# EasyEDA Pro project STEP Controller.eprj, schematic Schematic1, sheets 2 to 3 of 3

## Sheets
2 MCU: Page Name: MCU; Update Date: 2026-08-10
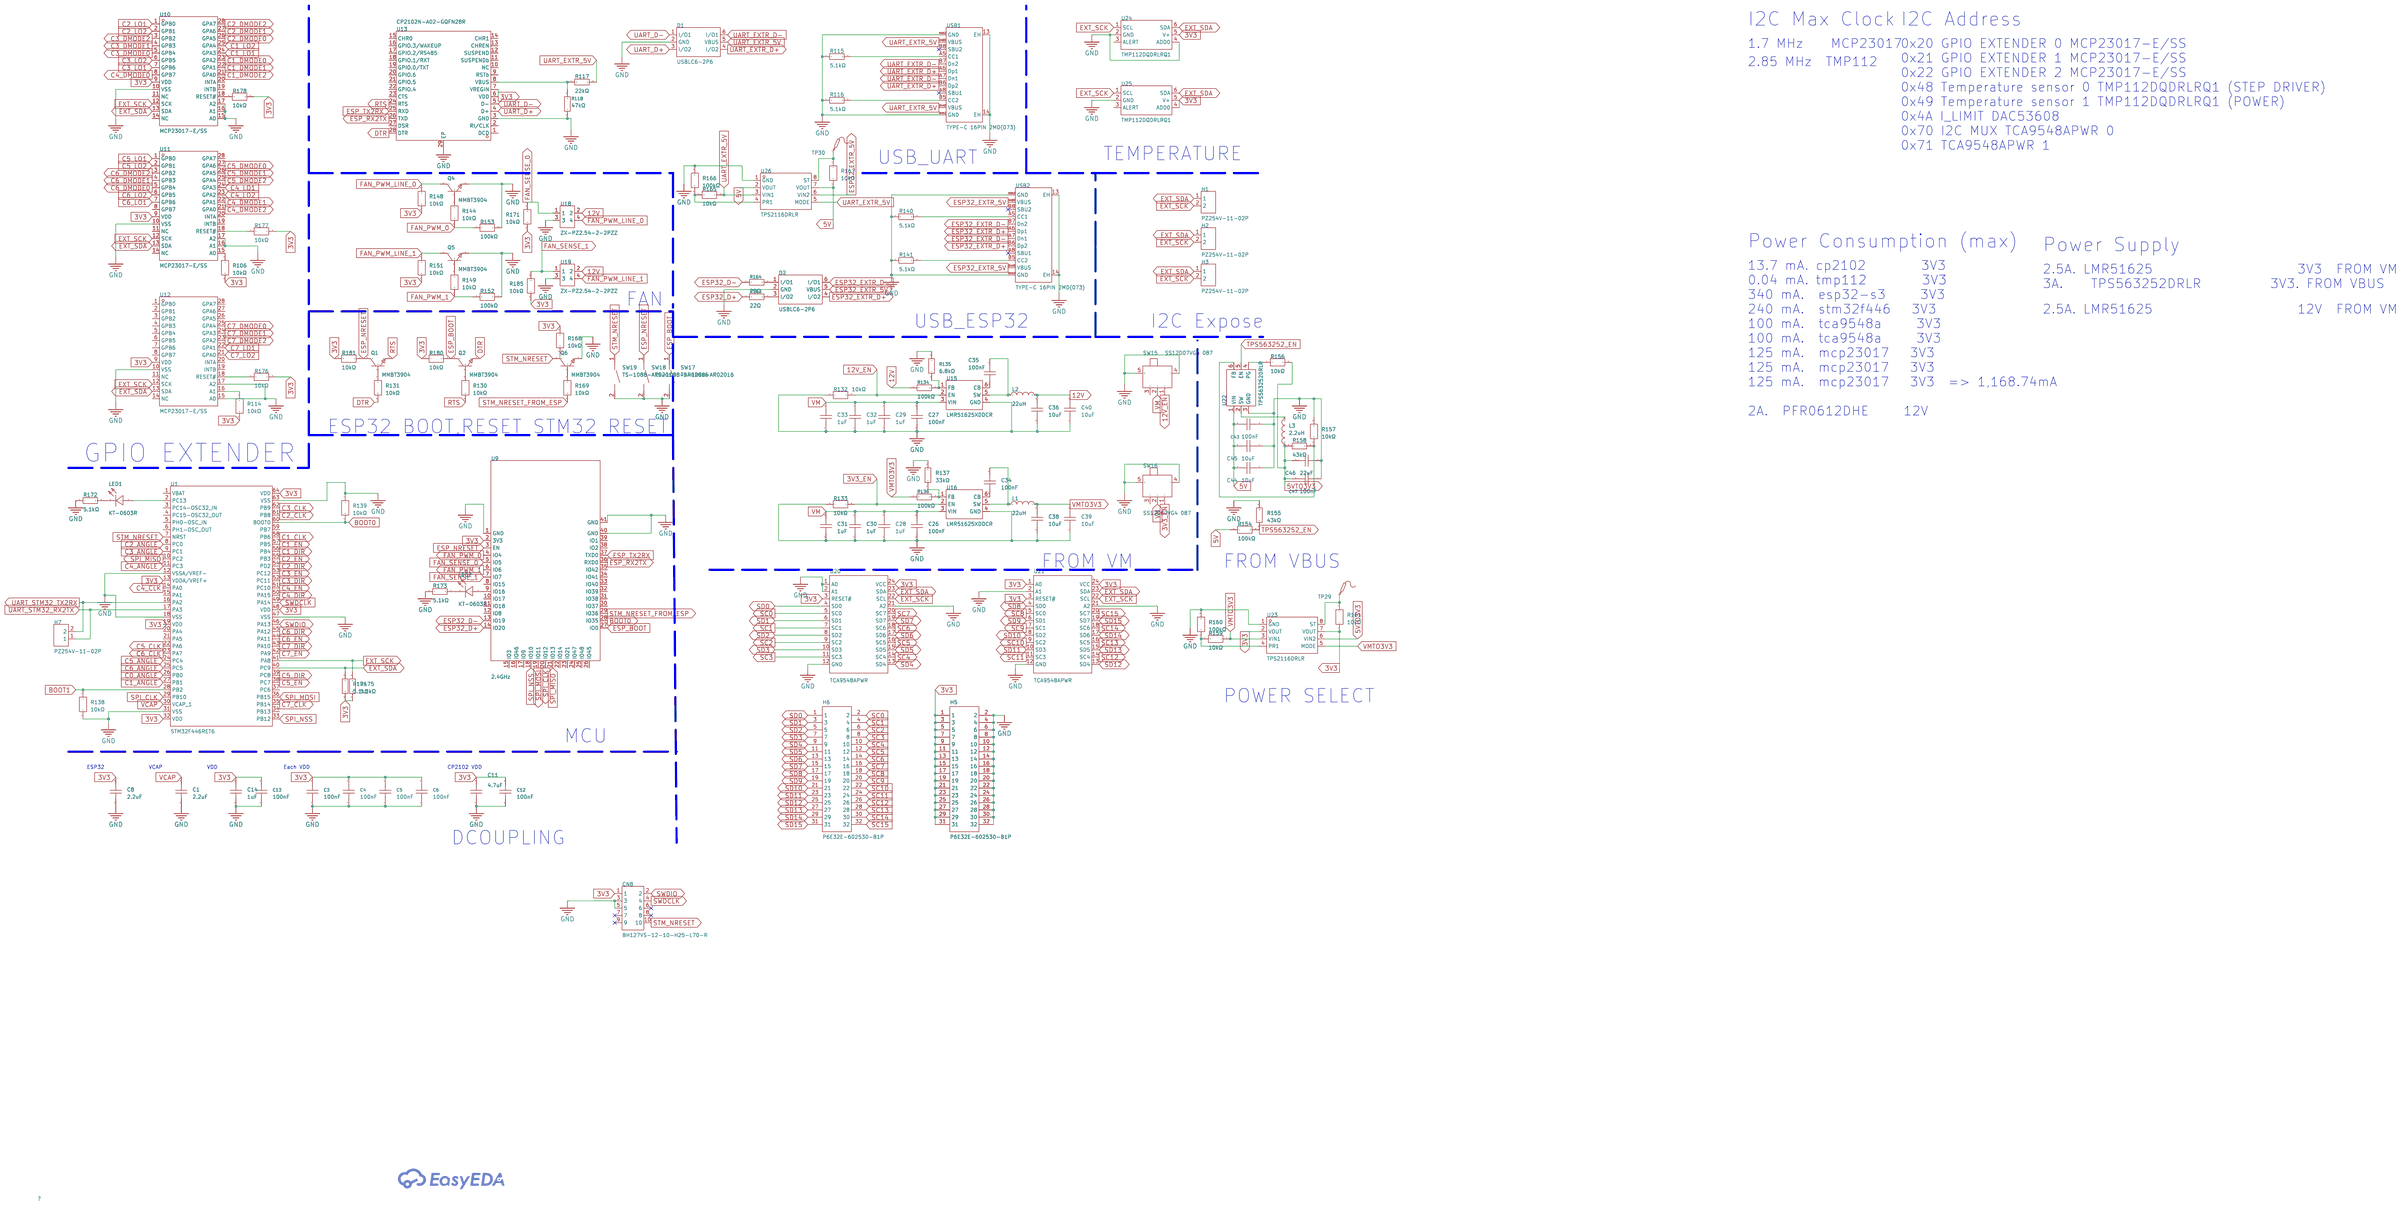
[diagram p1: MCU]
3 UserSelector: Create Date: 2026-05-20; Page Name: UserSelector; Update Date: 2026-06-08
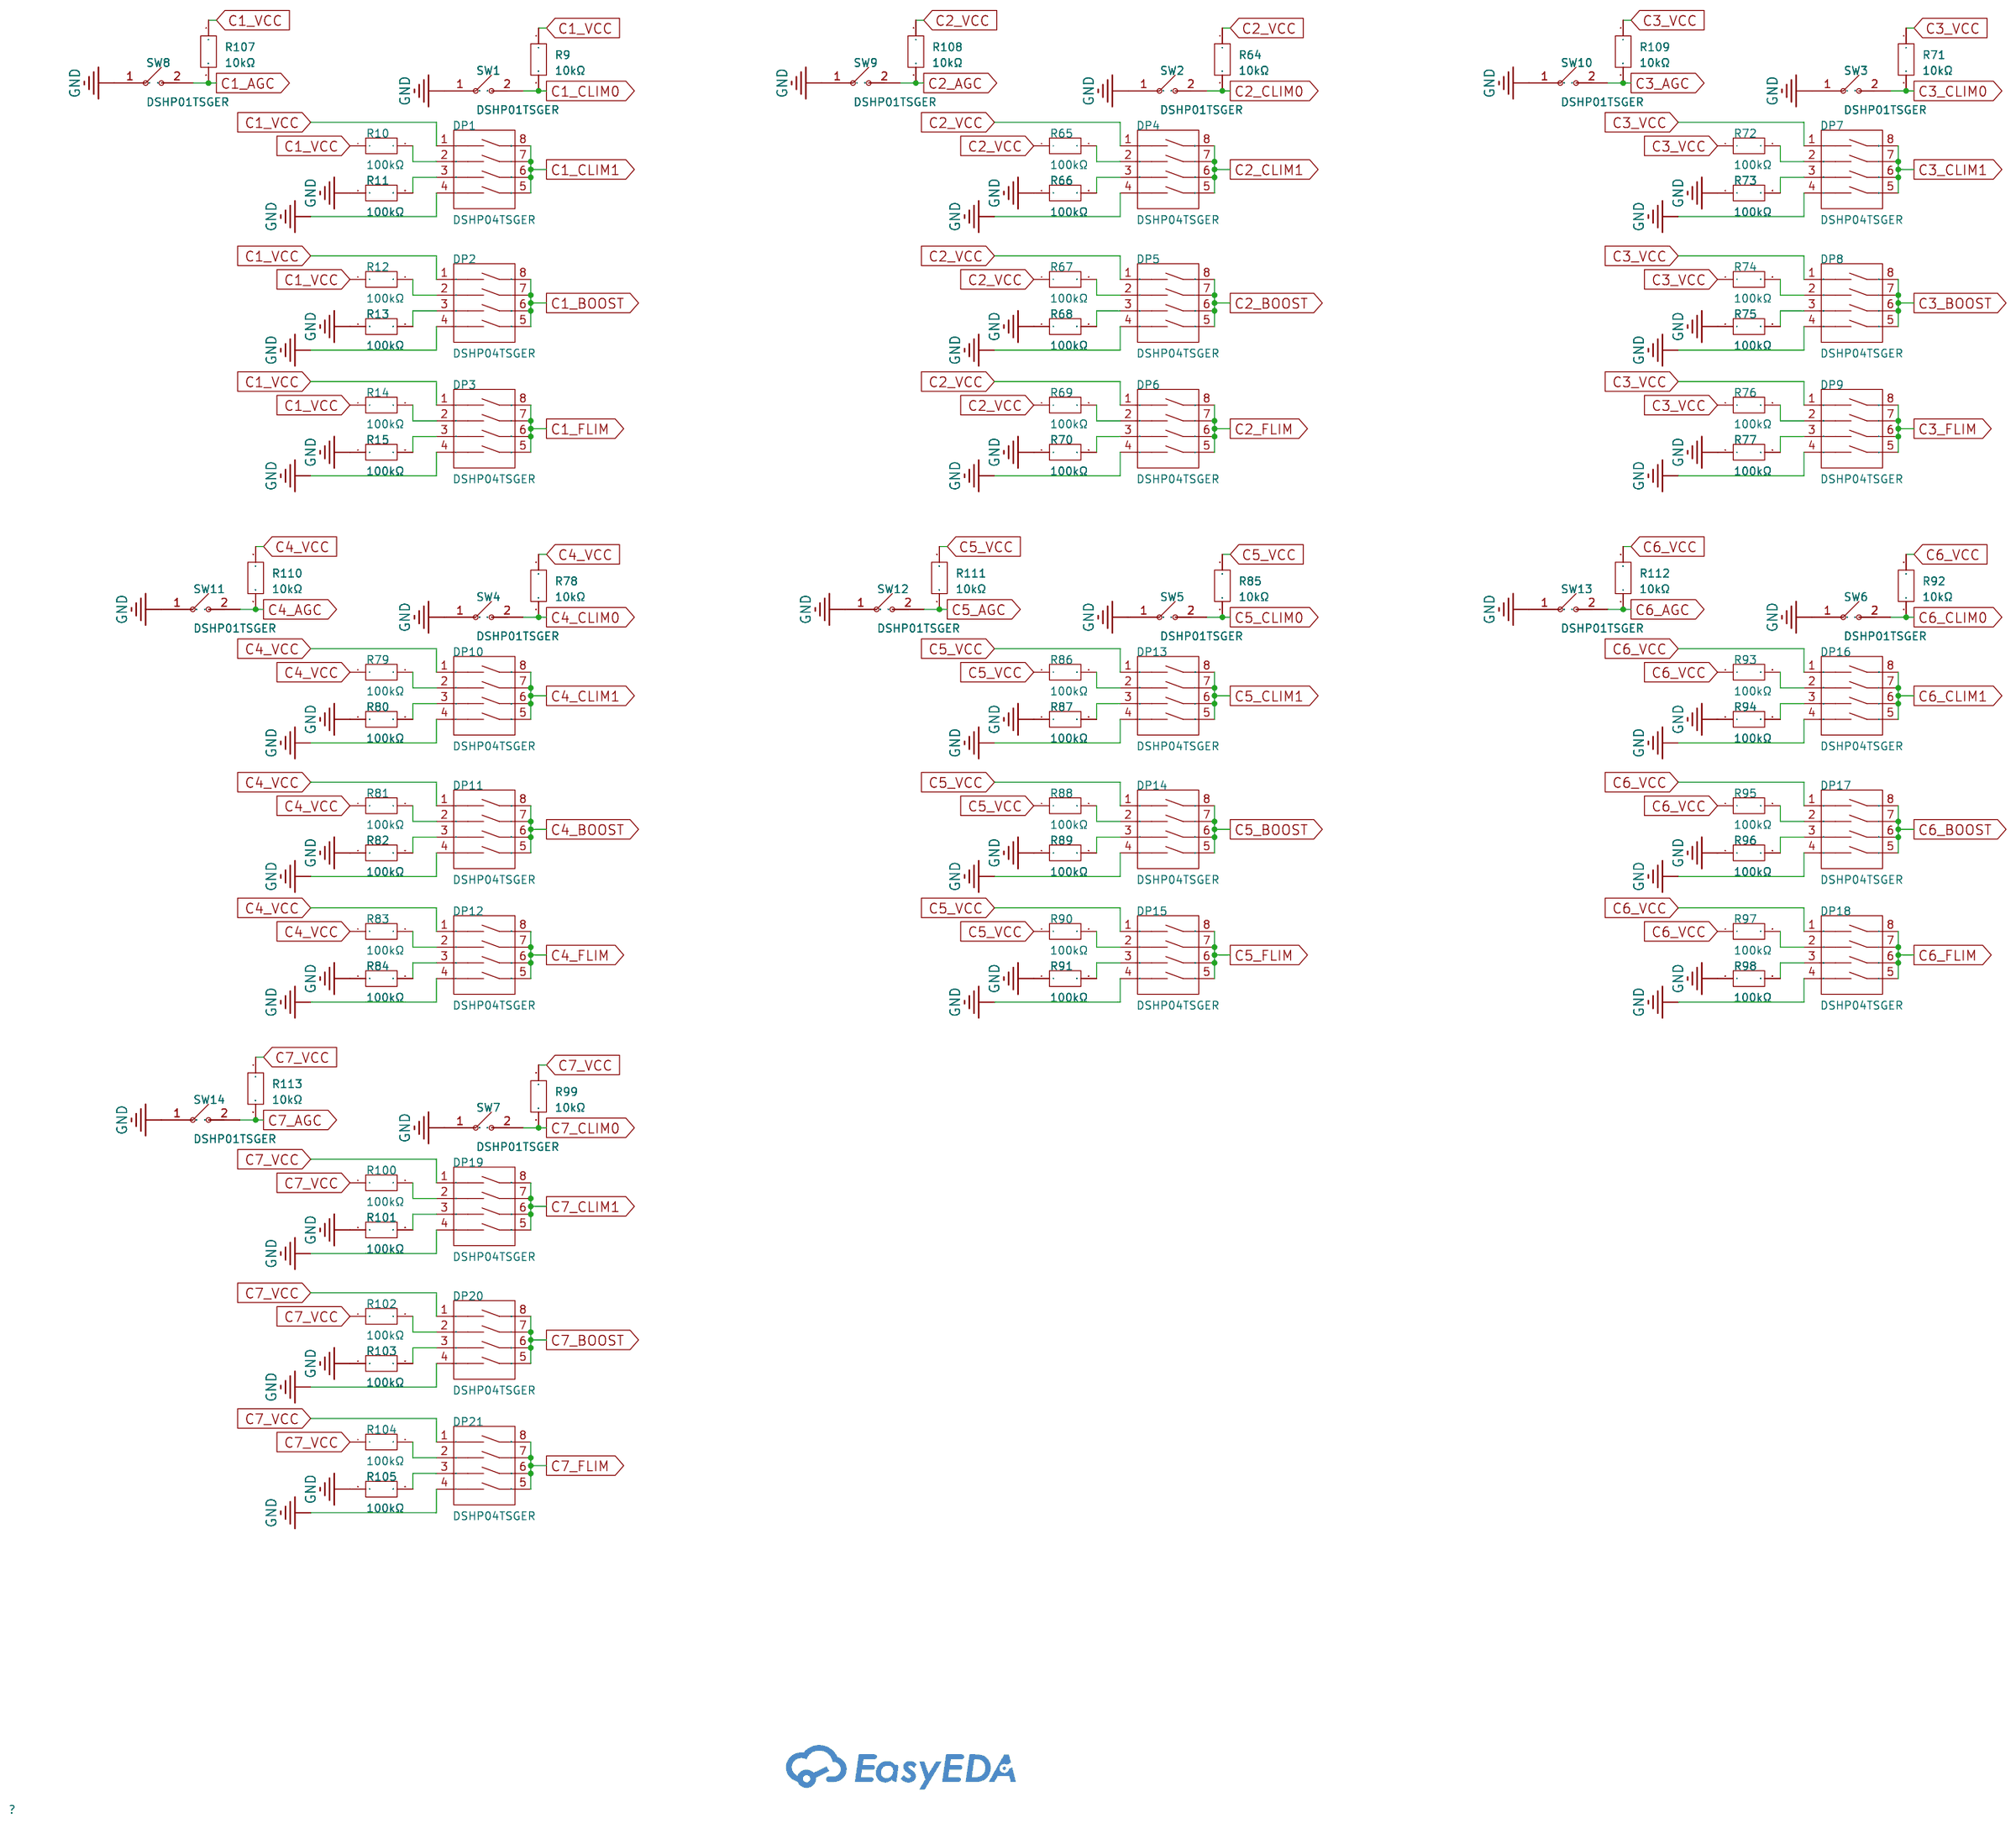
[diagram p2: UserSelector]

## Parts
sheet MCU
C1  2.2uF  [C0603]
C3  100nF  [C0603]
C4  100nF  [C0603]
C5  100nF  [C0603]
C6  100nF  [C0603]
C8  2.2uF  [C0603]
C11  4.7uF  [C0603]
C12  100nF  [C0603]
C13  100nF  [C0603]
C14  1uF  [C0603]
C26  100nF  [C0805]
C27  100nF  [C0805]
C28  1uF  [C0805]
C29  1uF  [C0805]
C30  1uF  [C0805]
C31  1uF  [C0805]
C32  1uF  [C0805]
C33  1uF  [C0805]
C34  100nF  [C0805]
C35  100nF  [C0805]
C36  10uF  [C0805]
C38  10uF  [C0805]
C39  10uF  [C0805]
C40  10uF  [C0805]
C43  100nF  [C0603]
C44  10uF  [C0805]
C45  10uF  [C0805]
C46  22uF  [C0603]
C47  100nF  [C0603]
CN8  BH127VS-12-10-H25-L70-R  [CONN-SMD_10P-P1.27-V-M-R2-C5-LS5.8_BH127VS-12-10-H25-L70-R]
D1  USBLC6-2P6  [SOT-563_L1.6-W1.2-P0.50-LS1.6-BL]
D2  USBLC6-2P6  [SOT-563_L1.6-W1.2-P0.50-LS1.6-BL]
H1  PZ254V-11-02P  [HDR-TH_2P-P2.54-V-M]
H2  PZ254V-11-02P  [HDR-TH_2P-P2.54-V-M]
H3  PZ254V-11-02P  [HDR-TH_2P-P2.54-V-M]
H5  P6E32E-602530-B1P  [HDR-TH_32P-P2.54_P6E32E-602530-B1P]
H6  P6E32E-602530-B1P  [HDR-TH_32P-P2.54_P6E32E-602530-B1P]
H7  PZ254V-11-02P  [HDR-TH_2P-P2.54-V-M]
L1  22uH  [IND-SMD_L10.0-W10.0-LS11.0]
L2  22uH  [IND-SMD_L10.0-W10.0-LS11.0]
L3  2.2uH  [L0805]
LED1  KT-0603R  [LED-SMD_L1.6-W0.8-R-RD]
LED2  KT-0603R  [LED-SMD_L1.6-W0.8-R-RD]
Q1  MMBT3904  [SOT-23-3_L2.9-W1.3-P1.90-LS2.4-BR]
Q2  MMBT3904  [SOT-23-3_L2.9-W1.3-P1.90-LS2.4-BR]
Q4  MMBT3904  [SOT-23-3_L2.9-W1.3-P1.90-LS2.4-BR]
Q5  MMBT3904  [SOT-23-3_L2.9-W1.3-P1.90-LS2.4-BR]
Q6  MMBT3904  [SOT-23-3_L2.9-W1.3-P1.90-LS2.4-BR]
R106  10kΩ  [R0603]
R114  10kΩ  [R0603]
R115  5.1kΩ  [R0603]
R116  5.1kΩ  [R0603]
R117  22kΩ  [R0603]
R118  47kΩ  [R0603]
R130  10kΩ  [R0603]
R131  10kΩ  [R0603]
R132  10kΩ  [R0603]
R133  10kΩ  [R0603]
R134  100kΩ  [R0402]
R135  6.8kΩ  [R0603]
R136  100kΩ  [R0402]
R137  33kΩ  [R0402]
R138  10kΩ  [R0603]
R139  10kΩ  [R0603]
R140  5.1kΩ  [R0603]
R141  5.1kΩ  [R0603]
R144  10kΩ  [R0603]
R148  10kΩ  [R0603]
R149  10kΩ  [R0603]
R151  10kΩ  [R0603]
R152  100kΩ  [R0603]
R153  100kΩ  [R0603]
R154  100kΩ  [R0603]
R155  43kΩ  [R0603]
R156  10kΩ  [R0603]
R157  10kΩ  [R0603]
R158  43kΩ  [R0603]
R159  10kΩ  [R0603]
R160  100kΩ  [R0603]
R161  10kΩ  [R0603]
R163  22Ω  [R0402]
R164  22Ω  [R0402]
R165  10kΩ  [R0603]
R166  100kΩ  [R0603]
R167  10kΩ  [R0603]
R168  10kΩ  [R0603]
R169  10kΩ  [R0603]
R171  10kΩ  [R0603]
R172  5.1kΩ  [R0603]
R173  5.1kΩ  [R0603]
R174  5.1kΩ  [R0603]
R175  5.1kΩ  [R0603]
R176  10kΩ  [R0603]
R177  10kΩ  [R0603]
R178  10kΩ  [R0603]
R180  10kΩ  [R0603]
R181  10kΩ  [R0603]
R185  10kΩ  [R0603]
SW15  SS12D07VG4 087  [SW-TH_SS12D07VG4]
SW16  SS12D07VG4 087  [SW-TH_SS12D07VG4]
SW17  TS-1088-AR02016  [SW-SMD_L3.9-W3.0-P4.45]
SW18  TS-1088-AR02016  [SW-SMD_L3.9-W3.0-P4.45]
SW19  TS-1088-AR02016  [SW-SMD_L3.9-W3.0-P4.45]
TP29  -  [Test-Point-0.5mm]
TP30  -  [Test-Point-0.5mm]
U1  STM32F446RET6  [LQFP-64_L10.0-W10.0-P0.50-LS12.0-BL]
U9  2.4GHz  [WIRELM-SMD_ESP32-S3-WROOM-1]
U10  MCP23017-E/SS  [SSOP-28_L10.2-W5.3-P0.65-LS7.8-BL]
U11  MCP23017-E/SS  [SSOP-28_L10.2-W5.3-P0.65-LS7.8-BL]
U12  MCP23017-E/SS  [SSOP-28_L10.2-W5.3-P0.65-LS7.8-BL]
U13  CP2102N-A02-GQFN28R  [QFN-28_L5.0-W5.0-P0.50-TL-EP3.3]
U15  LMR51625XDDCR  [SOT-23-6_L2.9-W1.6-P0.95-LS2.9-BL]
U16  LMR51625XDDCR  [SOT-23-6_L2.9-W1.6-P0.95-LS2.9-BL]
U18  ZX-PZ2.54-2-2PZZ  [HDR-TH_4P-P2.54-V-M-R2-C2-S2.54]
U19  ZX-PZ2.54-2-2PZZ  [HDR-TH_4P-P2.54-V-M-R2-C2-S2.54]
U20  TCA9548APWR  [TSSOP-24_L7.8-W4.4-P0.65-LS6.4-BL]
U21  TCA9548APWR  [TSSOP-24_L7.8-W4.4-P0.65-LS6.4-BL]
U22  TPS563252DRLR  [SOT-563-6_L1.6-W1.2-P0.50-LS1.6-BL]
U23  TPS2116DRLR  [SOT-583-8_L2.1-W1.6-P0.50-LS1.6-BL]
U24  TMP112DQDRLRQ1  [SOT-563-6_L1.6-W1.2-P0.50-LS1.6-BL]
U25  TMP112DQDRLRQ1  [SOT-563-6_L1.6-W1.2-P0.50-LS1.6-BL]
U26  TPS2116DRLR  [SOT-583-8_L2.1-W1.6-P0.50-LS1.6-BL]
USB1  TYPE-C 16PIN 2MD(073)  [USB-C-SMD_TYPE-C-16PIN-2MD-073]
USB2  TYPE-C 16PIN 2MD(073)  [USB-C-SMD_TYPE-C-16PIN-2MD-073]
sheet UserSelector
DP1  DSHP04TSGER  [SW-SMD_8P-L6.7-W5.4-P1.27-LS8.4]
DP2  DSHP04TSGER  [SW-SMD_8P-L6.7-W5.4-P1.27-LS8.4]
DP3  DSHP04TSGER  [SW-SMD_8P-L6.7-W5.4-P1.27-LS8.4]
DP4  DSHP04TSGER  [SW-SMD_8P-L6.7-W5.4-P1.27-LS8.4]
DP5  DSHP04TSGER  [SW-SMD_8P-L6.7-W5.4-P1.27-LS8.4]
DP6  DSHP04TSGER  [SW-SMD_8P-L6.7-W5.4-P1.27-LS8.4]
DP7  DSHP04TSGER  [SW-SMD_8P-L6.7-W5.4-P1.27-LS8.4]
DP8  DSHP04TSGER  [SW-SMD_8P-L6.7-W5.4-P1.27-LS8.4]
DP9  DSHP04TSGER  [SW-SMD_8P-L6.7-W5.4-P1.27-LS8.4]
DP10  DSHP04TSGER  [SW-SMD_8P-L6.7-W5.4-P1.27-LS8.4]
DP11  DSHP04TSGER  [SW-SMD_8P-L6.7-W5.4-P1.27-LS8.4]
DP12  DSHP04TSGER  [SW-SMD_8P-L6.7-W5.4-P1.27-LS8.4]
DP13  DSHP04TSGER  [SW-SMD_8P-L6.7-W5.4-P1.27-LS8.4]
DP14  DSHP04TSGER  [SW-SMD_8P-L6.7-W5.4-P1.27-LS8.4]
DP15  DSHP04TSGER  [SW-SMD_8P-L6.7-W5.4-P1.27-LS8.4]
DP16  DSHP04TSGER  [SW-SMD_8P-L6.7-W5.4-P1.27-LS8.4]
DP17  DSHP04TSGER  [SW-SMD_8P-L6.7-W5.4-P1.27-LS8.4]
DP18  DSHP04TSGER  [SW-SMD_8P-L6.7-W5.4-P1.27-LS8.4]
DP19  DSHP04TSGER  [SW-SMD_8P-L6.7-W5.4-P1.27-LS8.4]
DP20  DSHP04TSGER  [SW-SMD_8P-L6.7-W5.4-P1.27-LS8.4]
DP21  DSHP04TSGER  [SW-SMD_8P-L6.7-W5.4-P1.27-LS8.4]
R9  10kΩ  [R0603]
R10  100kΩ  [R0603]
R11  100kΩ  [R0603]
R12  100kΩ  [R0603]
R13  100kΩ  [R0603]
R14  100kΩ  [R0603]
R15  100kΩ  [R0603]
R64  10kΩ  [R0603]
R65  100kΩ  [R0603]
R66  100kΩ  [R0603]
R67  100kΩ  [R0603]
R68  100kΩ  [R0603]
R69  100kΩ  [R0603]
R70  100kΩ  [R0603]
R71  10kΩ  [R0603]
R72  100kΩ  [R0603]
R73  100kΩ  [R0603]
R74  100kΩ  [R0603]
R75  100kΩ  [R0603]
R76  100kΩ  [R0603]
R77  100kΩ  [R0603]
R78  10kΩ  [R0603]
R79  100kΩ  [R0603]
R80  100kΩ  [R0603]
R81  100kΩ  [R0603]
R82  100kΩ  [R0603]
R83  100kΩ  [R0603]
R84  100kΩ  [R0603]
R85  10kΩ  [R0603]
R86  100kΩ  [R0603]
R87  100kΩ  [R0603]
R88  100kΩ  [R0603]
R89  100kΩ  [R0603]
R90  100kΩ  [R0603]
R91  100kΩ  [R0603]
R92  10kΩ  [R0603]
R93  100kΩ  [R0603]
R94  100kΩ  [R0603]
R95  100kΩ  [R0603]
R96  100kΩ  [R0603]
R97  100kΩ  [R0603]
R98  100kΩ  [R0603]
R99  10kΩ  [R0603]
R100  100kΩ  [R0603]
R101  100kΩ  [R0603]
R102  100kΩ  [R0603]
R103  100kΩ  [R0603]
R104  100kΩ  [R0603]
R105  100kΩ  [R0603]
R107  10kΩ  [R0603]
R108  10kΩ  [R0603]
R109  10kΩ  [R0603]
R110  10kΩ  [R0603]
R111  10kΩ  [R0603]
R112  10kΩ  [R0603]
R113  10kΩ  [R0603]
SW1  DSHP01TSGER  [SW-SMD_DSHP01TSGER]
SW2  DSHP01TSGER  [SW-SMD_DSHP01TSGER]
SW3  DSHP01TSGER  [SW-SMD_DSHP01TSGER]
SW4  DSHP01TSGER  [SW-SMD_DSHP01TSGER]
SW5  DSHP01TSGER  [SW-SMD_DSHP01TSGER]
SW6  DSHP01TSGER  [SW-SMD_DSHP01TSGER]
SW7  DSHP01TSGER  [SW-SMD_DSHP01TSGER]
SW8  DSHP01TSGER  [SW-SMD_DSHP01TSGER]
SW9  DSHP01TSGER  [SW-SMD_DSHP01TSGER]
SW10  DSHP01TSGER  [SW-SMD_DSHP01TSGER]
SW11  DSHP01TSGER  [SW-SMD_DSHP01TSGER]
SW12  DSHP01TSGER  [SW-SMD_DSHP01TSGER]
SW13  DSHP01TSGER  [SW-SMD_DSHP01TSGER]
SW14  DSHP01TSGER  [SW-SMD_DSHP01TSGER]

## Library data of the parts
C1 C8 = CL10A225KO8NNNC: Capacitance:2.2uF Tolerance:±10% Tolerance:±10% Voltage Rating:16V Temperature Coefficient:X5R; LCSC Part Name: 2.2uF ±10% 16V; Supplier Part: C23630; Manufacturer: SAMSUNG(三星); Supplier Footprint: 0603; JLCPCB Part Class: Basic Part; Datasheet: https://item.szlcsc.com/datasheet/CL10A225KO8NNNC/24366.html; Supplier: LCSC; Tolerance: ±10%; Voltage Rating: 16V; Temperature Coefficient: X5R
C3-C6 C12 C13 C43 C47 = CC0603KRX7R9BB104: Capacitance:100nF Tolerance:±10% Tolerance:±10% Voltage Rating:50V Temperature Coefficient:X7R; LCSC Part Name: 100nF ±10% 50V; Supplier Part: C14663; Manufacturer: YAGEO(国巨); Supplier Footprint: 0603; JLCPCB Part Class: Basic Part; Datasheet: https://item.szlcsc.com/datasheet/CC0603KRX7R9BB104/15331.html; Supplier: LCSC; Tolerance: ±10%; Voltage Rating: 50V; Temperature Coefficient: X7R
C11 = CL10A475KO8NNNC: Capacitance:4.7uF Tolerance:±10% Tolerance:±10% Voltage Rating:16V Temperature Coefficient:X5R; LCSC Part Name: 4.7uF ±10% 16V; Supplier Part: C19666; Manufacturer: SAMSUNG(三星); Supplier Footprint: 0603; JLCPCB Part Class: Basic Part; Datasheet: https://item.szlcsc.com/datasheet/CL10A475KO8NNNC/20375.html; Supplier: LCSC; Tolerance: ±10%; Voltage Rating: 16V; Temperature Coefficient: X5R
C14 = CL10A105KB8NNNC: LCSC Part Name: 1uF ±10% 50V; Supplier Part: C15849; Manufacturer: SAMSUNG(三星); Supplier Footprint: 0603; JLCPCB Part Class: Basic Part; Datasheet: https://item.szlcsc.com/datasheet/CL10A105KB8NNNC/16531.html; Supplier: LCSC; Tolerance: ±10%; Voltage Rating: 50V; Temperature Coefficient: X5R
C26 C27 C34 C35 = CL21B104KCFNNNE: Capacitance:100nF Tolerance:±10% Tolerance:±10% Voltage Rating:100V Temperature Coefficient:X7R; LCSC Part Name: 100nF ±10% 100V; Supplier Part: C28233; Manufacturer: SAMSUNG(三星); Supplier Footprint: 0805; JLCPCB Part Class: Basic Part; Datasheet: https://item.szlcsc.com/datasheet/CL21B104KCFNNNE/28983.html; Supplier: LCSC; Tolerance: ±10%; Voltage Rating: 100V; Temperature Coefficient: X7R
C28-C33 = HHV0805R7105K101NSLJ: Capacitance:1uF Tolerance:±10% Tolerance:±10% Voltage Rating:100V Temperature Coefficient:X7R; LCSC Part Name: 1uF ±10% 100V; Supplier Part: C22367837; Manufacturer: Chinocera(华瓷); Supplier Footprint: 0805; JLCPCB Part Class: Extended Part; Datasheet: https://item.szlcsc.com/datasheet/HHV0805R7105K101NSLJ/23841142.html; Supplier: LCSC; Tolerance: ±10%; Voltage Rating: 100V; Temperature Coefficient: X7R
C36 C38-C40 C44 C45 = CL21A106KAYNNNE_C15850: LCSC Part Name: 10uF ±10% 25V; Supplier Part: C15850; Manufacturer: SAMSUNG(三星); Manufacturer Part: CL21A106KAYNNNE; Supplier Footprint: 0805; JLCPCB Part Class: Basic Part; Datasheet: https://item.szlcsc.com/datasheet/CL21A106KAYNNNE/16532.html; Supplier: LCSC; Tolerance: ±10%; Voltage Rating: 25V; Temperature Coefficient: X5R
C46 = CL10A226MQ8NRNC: LCSC Part Name: 22uF ±20% 6.3V; Supplier Part: C59461; Manufacturer: SAMSUNG(三星); Supplier Footprint: 0603; JLCPCB Part Class: Basic Part; Datasheet: https://item.szlcsc.com/datasheet/CL10A226MQ8NRNC/60514.html; Supplier: LCSC; Tolerance: ±20%; Voltage Rating: 6.3V; Temperature Coefficient: X5R
CN8 = BH127VS-12-10-H25-L70-R: LCSC Part Name: 1.27mm 2x5P 排数:2 每排P数:5; Supplier Part: C46971078; Manufacturer: XFCN(兴飞); Supplier Footprint: SMD,P=1.27mm; JLCPCB Part Class: Extended Part; Datasheet: https://item.szlcsc.com/datasheet/BH127VS-12-10-H25-L70-R/49149235.html; Supplier: LCSC; Pitch: 1.27mm; Number of Positions or Pins: 2x5P; Current Rating: 1A; Holder Type: Surface Mount,Vertical; Number of Rows: 2; Number of PINs Per Row: 5; Contact Material: Brass; Contact Plating: Gold; Operating Temperature: -40℃~+105℃; Color: Black
D1 D2 = USBLC6-2P6_C49451919: LCSC Part Name: 单向 5V 5.5A; Supplier Part: C49451919; Manufacturer: R+O(宏嘉诚); Supplier Footprint: SOT-563; JLCPCB Part Class: Extended Part; Datasheet: https://item.szlcsc.com/datasheet/USBLC6-2P6/51998875.html; Supplier: LCSC; Polarity: Unidirectional; Reverse Stand-Off Voltage (Vrwm): 5V; Clamping Voltage: 14V; Peak Pulse Current (Ipp): 5.5A; Peak Pulse Power Dissipation (Ppp): 80W; Voltage - Breakdown: 6V; Reverse Leakage Current (Ir): 80nA; Number of Channels: 2; Operating Temperature: -55℃~+150℃; Type: ESD; Junction Capacitance: 0.5pF
H1-H3 H7 = PZ254V-11-02P: LCSC Part Name: 1x2P 间距:2.54mm 方针 直插; Supplier Part: C492401; Manufacturer: XFCN(兴飞); Supplier Footprint: 插件,P=2.54mm; JLCPCB Part Class: Extended Part; Datasheet: https://item.szlcsc.com/datasheet/PZ254V-11-02P/502957.html; Supplier: LCSC; Pin Structure: 1x2P; Pitch: 2.54mm; Circluar Pins/Square Pins: Pin Header; Mounting Type: Through Hole; Number of Rows: 1; Number of Pins: 2P; Current Rating: 3A; Voltage Rating (Max): 250V; Length of Mating Pin: 6mm; Insulation Height: 2.5mm; Length of End Connection Pin: 3mm; Contact Material: Brass; Operating Temperature: -40℃~+105℃; Color: Black
H5 H6 = P6E32E-602530-B1P: Pin Structure:2x16P Pitch:2.54mm Row Spacing:2.54mm Circluar Pins/Square Pins:Pin Header Mounting Type:Through Hole Number of Rows:2 Number of Pins:32P Current Rating:3A Voltage Rating (Max):250V Length of Mating Pin:6mm Insulation Height:2.5mm Length of; LCSC Part Name: 2x16P 间距:2.54mm 方针 直插; Supplier Part: C49451395; Manufacturer: CHIN-BAN(勤本); Supplier Footprint: 插件,P=2.54mm; JLCPCB Part Class: Extended Part; Datasheet: https://item.szlcsc.com/datasheet/P6E32E-602530-B1P/51996702.html; Supplier: LCSC; Pin Structure: 2x16P; Pitch: 2.54mm; Row Spacing: 2.54mm; Circluar Pins/Square Pins: Pin Header; Mounting Type: Through Hole; Number of Rows: 2; Number of Pins: 32P; Current Rating: 3A; Voltage Rating (Max): 250V; Length of Mating Pin: 6mm; Insulation Height: 2.5mm; Length of End Connection Pin: 3mm; Contact Material: Brass; Contact Plating: Gold; Operating Temperature: -40℃~+105℃; Color: Black
L1 L2 = FXL1040-220-M: LCSC Part Name: 22uH ±20% 5.5A; Supplier Part: C475917; Manufacturer: cjiang(长江微电); Supplier Footprint: SMD,11.5x10mm; JLCPCB Part Class: Extended Part; Datasheet: https://item.szlcsc.com/datasheet/FXL1040-220-M/482450.html; Supplier: LCSC; Tolerance: ±20%; Current Rating: 5A; Current - Saturation(Isat): 5.5A; DC Resistance(DCR): 66mΩ; Type: Molded Inductor
L3 = CMI201209U2R2KT: LCSC Part Name: 2.2uH ±10%; Supplier Part: C1043; Manufacturer: FH(风华); Supplier Footprint: 0805; JLCPCB Part Class: Extended Part; Datasheet: https://item.szlcsc.com/datasheet/CMI201209U2R2KT/1395.html; Supplier: LCSC; Tolerance: ±10%; Current Rating: 50mA; DC Resistance(DCR): 600mΩ; Q @ Frequency: 35@10MHz; Frequency - Self Resonant: 50MHz
LED1 LED2 = KT-0603R: LCSC Part Name: 0603 红灯 高亮; Supplier Part: C2286; Manufacturer: KENTO; Supplier Footprint: 0603; JLCPCB Part Class: Basic Part; Datasheet: https://item.szlcsc.com/datasheet/KT-0603R/2659.html; Supplier: LCSC; Lamp Holder Type: 1.6mm x 0.8mm square LED; Illumination Color: Red; Voltage - Forward(Vf): 1.8V~2.4V; Power(Watts): 40mW; Forward Current: 20mA; Wavelength - Dominant: 615nm~630nm; Peak Wavelength: 645nm; Diode Configuration: Discrete Diode; Lens Color: Water Clear; Luminous Intensity: 300mcd; Viewing Angle: 120°; Operating Temperature: -40℃~+85℃
Q1 Q2 Q4-Q6 = MMBT3904_C51953474: LCSC Part Name: MMBT3904 hFE:100-300 NPN 晶体管 电流：200mA 电压：40V; Supplier Part: C51953474; Manufacturer: CCX(晁禾); Supplier Footprint: SOT-23; JLCPCB Part Class: Extended Part; Datasheet: https://item.szlcsc.com/datasheet/MMBT3904/54682184.html; Supplier: LCSC; type: NPN; Current - Collector(Ic): 200mA; Collector - Emitter Voltage VCEO: 40V; Pd - Power Dissipation: 200mW; DC Current Gain: 300@10mA,1V; Transition frequency(fT): 300MHz; Current - Collector Cutoff: 100nA; Vce Saturation(VCE(sat)): 300mV@50mA,5mA; Operating Temperature: -55℃~+150℃; Emitter-Base Voltage(Vebo): 6V; Number: 1 NPN Transistor
R9 R64 R71 R78 R85 R92 R99 R106-R114 R130-R133 R138 R139 R144 R148 R149 R151 R156 R157 R159 R161 R165 R167-R169 R171 R176-R178 R180 R181 R185 = 0603WAF1002T5E: Type:Thick Film Resistor Resistance:10kΩ Tolerance:±1% Tolerance:±1% Power(Watts):100mW Voltage-Supply(Max):75V Temperature Coefficient:±100ppm/℃ Temperature Coefficient:±100ppm/℃ Operating Temperature:-55℃~+155℃ Operating Temperature:-55℃~+155℃; LCSC Part Name: 厚膜电阻 10kΩ ±1% 100mW; Supplier Part: C25804; Manufacturer: UNI-ROYAL(厚声); Supplier Footprint: 0603; JLCPCB Part Class: Basic Part; Datasheet: https://item.szlcsc.com/datasheet/0603WAF1002T5E/26547.html; Supplier: LCSC; Type: Thick Film Resistor; Tolerance: ±1%; Power(Watts): 100mW; Voltage-Supply(Max): 75V; Temperature Coefficient: ±100ppm/℃; Operating Temperature: -55℃~+155℃
R115 R116 R140 R141 R172-R175 = 0603WAF5101T5E: Type:Thick Film Resistor Resistance:5.1kΩ Tolerance:±1% Tolerance:±1% Power(Watts):100mW Voltage-Supply(Max):75V Temperature Coefficient:±100ppm/℃ Temperature Coefficient:±100ppm/℃ Operating Temperature:-55℃~+155℃ Operating Temperature:-55℃~+155℃; LCSC Part Name: 5.1kΩ ±1% 100mW 厚膜电阻; Supplier Part: C23186; Manufacturer: UNI-ROYAL(厚声); Supplier Footprint: 0603; JLCPCB Part Class: Basic Part; Datasheet: https://item.szlcsc.com/datasheet/0603WAF5101T5E/23913.html; Supplier: LCSC; Type: Thick Film Resistor; Tolerance: ±1%; Power(Watts): 100mW; Voltage-Supply(Max): 75V; Temperature Coefficient: ±100ppm/℃; Operating Temperature: -55℃~+155℃
R117 = 0603WAF2202T5E: Type:Thick Film Resistor Resistance:22kΩ Tolerance:±1% Tolerance:±1% Power(Watts):100mW Voltage-Supply(Max):75V Temperature Coefficient:±100ppm/℃ Temperature Coefficient:±100ppm/℃ Operating Temperature:-55℃~+155℃ Operating Temperature:-55℃~+155℃; LCSC Part Name: 22kΩ ±1% 100mW 厚膜电阻; Supplier Part: C31850; Manufacturer: UNI-ROYAL(厚声); Supplier Footprint: 0603; JLCPCB Part Class: Basic Part; Datasheet: https://item.szlcsc.com/datasheet/0603WAF2202T5E/32812.html; Supplier: LCSC; Type: Thick Film Resistor; Tolerance: ±1%; Power(Watts): 100mW; Voltage-Supply(Max): 75V; Temperature Coefficient: ±100ppm/℃; Operating Temperature: -55℃~+155℃
R118 = 0603WAF4702T5E: Type:Thick Film Resistor Resistance:47kΩ Tolerance:±1% Tolerance:±1% Power(Watts):100mW Voltage-Supply(Max):75V Temperature Coefficient:±100ppm/℃ Temperature Coefficient:±100ppm/℃ Operating Temperature:-55℃~+155℃ Operating Temperature:-55℃~+155℃; LCSC Part Name: 47kΩ ±1% 100mW 厚膜电阻; Supplier Part: C25819; Manufacturer: UNI-ROYAL(厚声); Supplier Footprint: 0603; JLCPCB Part Class: Basic Part; Datasheet: https://item.szlcsc.com/datasheet/0603WAF4702T5E/26562.html; Supplier: LCSC; Type: Thick Film Resistor; Tolerance: ±1%; Power(Watts): 100mW; Voltage-Supply(Max): 75V; Temperature Coefficient: ±100ppm/℃; Operating Temperature: -55℃~+155℃
R134 R136 = 0402WGF1003TCE: LCSC Part Name: 100kΩ ±1% 62.5mW 厚膜电阻; Supplier Part: C25741; Manufacturer: UNI-ROYAL(厚声); Supplier Footprint: 0402; JLCPCB Part Class: Basic Part; Datasheet: https://item.szlcsc.com/datasheet/0402WGF1003TCE/26484.html; Supplier: LCSC; Type: Thick Film Resistor; Tolerance: ±1%; Power(Watts): 62.5mW; Voltage-Supply(Max): 50V; Temperature Coefficient: ±100ppm/℃; Operating Temperature: -55℃~+155℃
R135 = 0603WAF6801T5E: LCSC Part Name: 6.8kΩ ±1% 100mW 厚膜电阻; Supplier Part: C23212; Manufacturer: UNI-ROYAL(厚声); Supplier Footprint: 0603; JLCPCB Part Class: Basic Part; Datasheet: https://item.szlcsc.com/datasheet/0603WAF6801T5E/23939.html; Supplier: LCSC; Type: Thick Film Resistor; Tolerance: ±1%; Power(Watts): 100mW; Voltage-Supply(Max): 75V; Temperature Coefficient: ±100ppm/℃; Operating Temperature: -55℃~+155℃
R137 = 0402WGF3302TCE: LCSC Part Name: 33kΩ ±1% 62.5mW 厚膜电阻; Supplier Part: C25779; Manufacturer: UNI-ROYAL(厚声); Supplier Footprint: 0402; JLCPCB Part Class: Basic Part; Datasheet: https://atta.szlcsc.com/upload/public/pdf/source/20200306/C422600_1E6D84923E4A46A82E41ADD87F860B5C.pdf; Supplier: LCSC; Type: Thick Film Resistors; Tolerance: ±1%; Temperature Coefficient: ±100ppm/℃; Operating Temperature Range: -55℃~+155℃
R10-R15 R65-R70 R72-R77 R79-R84 R86-R91 R93-R98 R100-R105 R152-R154 R160 R166 = 0603WAF1003T5E: Type:Thick Film Resistor Resistance:100kΩ Tolerance:±1% Tolerance:±1% Power(Watts):100mW Voltage-Supply(Max):75V Temperature Coefficient:±100ppm/℃ Temperature Coefficient:±100ppm/℃ Operating Temperature:-55℃~+155℃ Operating Temperature:-55℃~+155℃; LCSC Part Name: 100kΩ ±1% 100mW 厚膜电阻; Supplier Part: C25803; Manufacturer: UNI-ROYAL(厚声); Supplier Footprint: 0603; JLCPCB Part Class: Basic Part; Datasheet: https://item.szlcsc.com/datasheet/0603WAF1003T5E/26546.html; Supplier: LCSC; Type: Thick Film Resistor; Tolerance: ±1%; Power(Watts): 100mW; Voltage-Supply(Max): 75V; Temperature Coefficient: ±100ppm/℃; Operating Temperature: -55℃~+155℃
R155 R158 = 0603WAF4302T5E: LCSC Part Name: 43kΩ ±1% 100mW 厚膜电阻; Supplier Part: C23172; Manufacturer: UNI-ROYAL(厚声); Supplier Footprint: 0603; JLCPCB Part Class: Extended Part; Datasheet: https://item.szlcsc.com/datasheet/0603WAF4302T5E/23899.html; Supplier: LCSC; Type: Thick Film Resistor; Tolerance: ±1%; Power(Watts): 100mW; Voltage-Supply(Max): 75V; Temperature Coefficient: ±100ppm/℃; Operating Temperature: -55℃~+155℃
R163 R164 = 0402WGF220JTCE: LCSC Part Name: 22Ω ±1% 62.5mW 厚膜电阻; Supplier Part: C25092; Manufacturer: UNI-ROYAL(厚声); Supplier Footprint: 0402; JLCPCB Part Class: Basic Part; Datasheet: https://atta.szlcsc.com/upload/public/pdf/source/20200306/C422600_1E6D84923E4A46A82E41ADD87F860B5C.pdf; Supplier: LCSC; Type: Thick Film Resistors; Tolerance: ±1%; Temperature Coefficient: ±100ppm/℃; Operating Temperature Range: -55℃~+155℃
SW15 SW16 = SS12D07VG4 087: LCSC Part Name: SS12D07VG4; Supplier Part: C2939726; Manufacturer: SHOU HAN(首韩); Supplier Footprint: 插件,8.7x4.4mm; JLCPCB Part Class: Extended Part; Datasheet: https://item.szlcsc.com/datasheet/SS12D07VG4%2520087/3301205.html; Supplier: LCSC; Circuit: SPDT; Termination Style: PC Pin; Length: 8.7mm; Width: 4.4mm; Switch Height: 4.7mm; Mounting Type: Through Hole; Current Rating: 500mA; Voltage Rating: 50V; Life: 5,000 cycles; Operating Temperature: -10℃~+50℃
SW17-SW19 = TS-1088-AR02016: LCSC Part Name: 3.9*3*2mm 立贴 轻触开关; Supplier Part: C720477; Manufacturer: XUNPU(讯普); Supplier Footprint: SMD,4x3mm; JLCPCB Part Class: Basic Part; Datasheet: https://item.szlcsc.com/datasheet/TS-1088-AR02016/763484.html; Supplier: LCSC; Circuit: SPST; Actuator Style: Round Button; Operating Force: 1.6N; Mounting Type: Surface Mount,Vertical; Length: 3.9mm; Width: 3mm; Switch Height: 2mm; with Bracket: Without Bracket; Contact Current: 50mA; Voltage Rating: 12V; Actuator/Cap Color: Black; Termination Style: SMD(SMT) Tab; Life: 100,000 cycles; Operating Temperature: -30℃~+80℃
TP29 TP30 = Test-Point
U1 = STM32F446RET6: LCSC Part Name: MSL=3 带DSP和FPU的高性能基础系列ARM Cortex-M4 MCU，具有512 KB Flash、180 MHz CPU、ART加速器和双QSPI; Supplier Part: C69336; Manufacturer: ST(意法半导体); Supplier Footprint: LQFP-64(10x10); JLCPCB Part Class: Extended Part; Datasheet: https://item.szlcsc.com/datasheet/STM32F446RET6/70451.html; Supplier: LCSC; CPU Core: ARM-M4; CPU Maximum Speed: 180MHz; CPU Bit Width: 32bit; Program Storage Size: 512KB; Program Memory Type: FLASH; Number of I/O: 50; ADC (Bit): 12bit; DAC (Bit): 12bit; Voltage - Supply: 1.7V~3.6V
U9 = ESP32-S3-WROOM-1-N16R8: LCSC Part Name: 不带固件 通用型Wi-Fi+低功耗蓝牙MCU模组; Supplier Part: C2913202; Manufacturer: ESPRESSIF(乐鑫); Supplier Footprint: SMD,25.5x18mm; JLCPCB Part Class: Extended Part; Datasheet: https://item.szlcsc.com/datasheet/ESP32-S3-WROOM-1-N16R8/3198300.html; Supplier: LCSC; Utilized IC / Part: ESP32-S3R8; Interface Type: I2C；GPIO；UART；SPI；USB；I2S; Antenna Type: On-board PCB Antenna; Output Power: 20.5dBm; Voltage - Supply: 3V~3.6V; Receive  Current: 95mA; Send  Current: 355mA; Sensitivity: -103.5dBm; Operating Temperature: -40℃~+65℃
U10-U12 = MCP23017-E/SS: LCSC Part Name: 16位带串行接口的I/O扩展器; Supplier Part: C506653; Manufacturer: MICROCHIP(美国微芯); Supplier Footprint: SSOP-28(5.3x10.2x0.65); JLCPCB Part Class: Extended Part; Datasheet: https://item.szlcsc.com/datasheet/MCP23017-E%252FSS/519857.html; Supplier: LCSC; Interface: I2C; Number of I/O: 16; Interrupt Output: Interrupt Output; Voltage - Supply: 1.8V~5.5V; Current - Output Low(IOL): 8mA; Clock Frequency: 1.7MHz; Operating Temperature: -40℃~+125℃; Number of Supporting Devices: 8; Quiescent Current: 1uA; Output Logic Level - Low: 600mV
U13 = CP2102N-A02-GQFN28R: LCSC Part Name: USB转UART桥接器; Supplier Part: C964632; Manufacturer: SKYWORKS/SILICON LABS(芯科); Supplier Footprint: QFN-28-EP(5x5); JLCPCB Part Class: Extended Part; Datasheet: https://item.szlcsc.com/datasheet/CP2102N-A02-GQFN28R/1049893.html; Supplier: LCSC; Applications Function: USB to UART; USB Protocol: USB 2.0; Voltage - Supply: 3V~3.6V; Operating Temperature: -40℃~+85℃@(Ta); Current - Supply: 9.5mA; Quiescent Supply Current: 1.3uA
U15 U16 = LMR51625XDDCR_C44750835: Supplier Part: C44750835; Manufacturer: TI(德州仪器); Supplier Footprint: TSOT-23-6; JLCPCB Part Class: Extended Part; Datasheet: https://www.ti.com/lit/ds/symlink/lmr51625.pdf; Supplier: LCSC
U18 U19 = ZX-PZ2.54-2-2PZZ: LCSC Part Name: 2x2P 间距:2.54mm 方针 直插; Supplier Part: C7501273; Manufacturer: Megastar(兆星); Supplier Footprint: 插件,P=2.54mm; JLCPCB Part Class: Extended Part; Datasheet: https://atta.szlcsc.com/upload/public/pdf/source/20231122/911B69827DB23C9F0677528E625190D5.pdf; Supplier: LCSC; Pin Structure: 2x2P; Pitch: 2.54mm; Row Spacing: 2.54mm; Circluar Pins/Square Pins: Policy; Mounting Type: Straight; Number of Rows: Double Row; Number of Pins: 4P; Current Rating: 3A; Voltage Rating (Max): 1kV; Length of Mating Pin: 6mm; Insulation Height: 2.5mm; Length of End Connection Pin: 3mm; Contact Material: Brass; Contact Plating: Gold; Operating Temperature: -40℃~+105℃; Color: Black
U20 U21 = TCA9548APWR: LCSC Part Name: 支持复位的低压8通道I²C开关; Supplier Part: C130026; Manufacturer: TI(德州仪器); Supplier Footprint: TSSOP-24; JLCPCB Part Class: Extended Part; Datasheet: https://www.ti.com/cn/lit/gpn/tca9548a; Supplier: LCSC
U22 = TPS563252DRLR: LCSC Part Name: 3V至17V输入、3A输出同步降压转换器; Supplier Part: C19188399; Manufacturer: TI(德州仪器); Supplier Footprint: SOT-6(5x3); JLCPCB Part Class: Extended Part; Datasheet: https://item.szlcsc.com/datasheet/TPS563252DRLR/20409048.html; Supplier: LCSC; Voltage - Supply: 3V~17V; Output Current: 3A; Frequency - Switching: 1.2MHz; Operating Temperature: -40℃~+125℃@(TJ); Synchronous Rectifier: Yes; Number of Outputs: 1; Topology: Buck; Switch tube (built-in/external): Built-in
U23 U26 = TPS2116DRLR: LCSC Part Name: 具有手动和优先级切换功能的1.6V至5.5V、2.5A低IQ电源多路复用器; Supplier Part: C3235557; Manufacturer: TI(德州仪器); Supplier Footprint: SOT-583; JLCPCB Part Class: Extended Part; Datasheet: https://www.ti.com/cn/lit/gpn/tps2116; Supplier: LCSC; Features: Operation status indication
U24 U25 = TMP112DQDRLRQ1: Supplier Part: C49252344; Manufacturer: TI(德州仪器); Supplier Footprint: SOT-563-6; JLCPCB Part Class: Extended Part; Supplier: LCSC
USB1 USB2 = TYPE-C 16PIN 2MD(073): LCSC Part Name: Type-C 母 卧贴; Supplier Part: C2765186; Manufacturer: SHOU HAN(首韩); Supplier Footprint: SMD; JLCPCB Part Class: Extended Part; Datasheet: https://item.szlcsc.com/datasheet/TYPE-C%252016PIN%25202MD(073)/2901843.html; Supplier: LCSC; Connector Type: Type-C; Gender: Female; Mounting Type: Surface Mount, Right Angle; Number of Contacts: 16P; Number of Ports: 1; Current Rating-Power: 3A; Voltage Rating: 5V; Connect-Disconnect Life: 10,000 Cycles; Detection color: Black; Operating Temperature: -25℃~+85℃
DP1-DP21 = DSHP04TSGER_C3293144: LCSC Part Name: 4位 1.27mm间距贴片型 KE拨码开关; Supplier Part: C3293144; Manufacturer: 康深; Supplier Footprint: SMD,P=1.27mm; JLCPCB Part Class: Extended Part; Datasheet: https://item.szlcsc.com/datasheet/DSHP04TSGER/3856579.html; Supplier: LCSC; Circuit: SPST; Number of Positions: 4; Lead Pitch: 1.27mm; Current Rating: 25mA; Voltage Rating: 24V; Operating Temperature: -30℃~+85℃; Operating Life: 3,000 Cycles; Color: Black
SW1-SW14 = DSHP01TSGER: LCSC Part Name: 1位单PIN 1.27mm间距贴片型 KE拨码开关 编码开关; Supplier Part: C3293141; Manufacturer: 康深; Supplier Footprint: SMD; JLCPCB Part Class: Extended Part; Datasheet: https://item.szlcsc.com/datasheet/DSHP01TSGER/3856576.html; Supplier: LCSC; Circuit: SPST; Number of Positions: 1; Current Rating: 25mA; Voltage Rating: 24V; Operating Temperature: -30℃~+85℃; Operating Life: 3,000 Cycles; Color: Black

## Nets
3V3: C3.2 C4.2 C5.2 C6.2 C8.2 C11.2 C12.2 C13.2 C14.2 CN8.1 H5.1 H5.3 H5.5 H5.7 H5.9 H5.11 H5.13 H5.15 H5.17 H5.19 H5.21 H5.23 H5.25 H5.27 H5.29 H5.31 R106.2 R114.2 R148.2 R151.2 R161.2 R168.1 R171.2 R174.1 R175.1 R176.2 R177.2 R178.2 R180.1 R181.1 R185.1 U1.13(VDDA/VREF+) U1.19(VDD) U1.32(VDD) U1.48(VDD) U1.64(VDD) U9.2(3V3) U10.9(VDD) U11.9(VDD) U12.9(VDD) U13.6(VDD) U13.7(VREGIN) U20.3(RESET#) U20.24(VCC) U21.1(A0) U21.3(RESET#) U21.24(VCC) U23.2(VOUT) U23.7(VOUT) U24.5(V+) U25.4(ADD0) U25.5(V+) ; also on sheet 1
3V3_EN: R133.2 SW16.1 U16.2(EN)
5V: C43.2 C44.2 C45.2 R154.1 R167.2 U22.1(VIN) U26.2(VOUT) U26.7(VOUT) ; also on sheet 1
5VTO3V3: C46.1 C47.2 L3.1 R156.2 R158.1 U23.6(VIN2)
12V: C36.2 C40.2 L2.2 R134.1 U18.2 U19.2 ; also on sheet 1
12V_EN: R132.2 SW15.1 U15.2(EN)
GND: C1.1 C3.1 C4.1 C5.1 C6.1 C8.1 C11.1 C12.1 C13.1 C14.1 C26.1 C27.1 C28.1 C29.1 C30.1 C31.1 C32.1 C33.1 C36.1 C38.1 C39.1 C40.1 C43.1 C44.1 C45.1 C46.2 C47.1 CN8.3 CN8.5 D1.2(GND) D2.2(GND) DP1.4 DP2.4 DP3.4 DP4.4 DP5.4 DP6.4 DP7.4 DP8.4 DP9.4 DP10.4 DP11.4 DP12.4 DP13.4 DP14.4 DP15.4 DP16.4 DP17.4 DP18.4 DP19.4 DP20.4 DP21.4 H5.2 H5.4 H5.6 H5.8 H5.10 H5.12 H5.14 H5.16 H5.18 H5.20 H5.22 H5.24 H5.26 H5.28 H5.30 H5.32 Q4.2(E) Q5.2(E) Q6.2(E) R11.1 R13.1 R15.1 R66.1 R68.1 R70.1 R73.1 R75.1 R77.1 R80.1 R82.1 R84.1 R87.1 R89.1 R91.1 R94.1 R96.1 R98.1 R101.1 R103.1 R105.1 R115.1 R116.1 R118.2 R132.1 R133.1 R135.2 R137.2 R138.2 R139.1 R140.1 R141.1 R152.2 R153.2 R155.2 R157.2 R160.2 R166.2 R172.1 R173.1 SW1.1 SW2.1 SW3.1 SW4.1 SW5.1 SW6.1 SW7.1 SW8.1 SW9.1 SW10.1 SW11.1 SW12.1 SW13.1 SW14.1 SW15.4 SW15.5 SW16.4 SW16.5 SW17.2 SW18.2 SW19.2 U1.12(VSSA/VREF-) U1.18(VSS) U1.31(VSS) U1.47(VSS) U1.63(VSS) U9.1(GND) U9.40(GND) U9.41(GND) U10.10(VSS) U10.15(A0) U10.16(A1) U10.17(A2) U11.10(VSS) U11.16(A1) U11.17(A2) U12.10(VSS) U12.15(A0) U12.17(A2) U13.3(GND) U13.29(EP) U15.4(GND) U16.4(GND) U18.3 U19.3 U20.1(A0) U20.2(A1) U20.12(GND) U20.21(A2) U21.2(A1) U21.12(GND) U21.21(A2) U22.3(GND) U23.1(GND) U24.2(GND) U24.4(ADD0) U25.2(GND) U26.1(GND) USB1.13(EH) USB1.14(EH) USB1.A1B12(GND) USB1.B1A12(GND) USB2.13(EH) USB2.14(EH) USB2.A1B12(GND) USB2.B1A12(GND) ; also on sheet 1
BOOT0: R139.2 U1.60(BOOT0) U9.28(IO35)
BOOT1: R138.1 U1.28(PB2)
C0_ANGLE: U1.26(PB0)
C1_AGC: R107.2 SW8.2 ; also on sheet 1
C1_ANGLE: U1.27(PB1)
C1_BOOST: DP2.5 DP2.6 DP2.7 DP2.8 ; also on sheet 1
C1_CLIM0: R9.2 SW1.2 ; also on sheet 1
C1_CLIM1: DP1.5 DP1.6 DP1.7 DP1.8 ; also on sheet 1
C1_CLK: U1.58(PB6) ; also on sheet 1
C1_DIR: U1.56(PB4) ; also on sheet 1
C1_DMODE0: U10.23(GPA2) ; also on sheet 1
C1_DMODE1: U10.22(GPA1) ; also on sheet 1
C1_DMODE2: U10.21(GPA0) ; also on sheet 1
C1_EN: U1.57(PB5) ; also on sheet 1
C1_FLIM: DP3.5 DP3.6 DP3.7 DP3.8 ; also on sheet 1
C1_LO1: U10.24(GPA3) ; also on sheet 1
C1_LO2: U10.25(GPA4) ; also on sheet 1
C1_VCC: DP1.1 DP2.1 DP3.1 R9.1 R10.1 R12.1 R14.1 R107.1 ; also on sheet 1
C2_AGC: R108.2 SW9.2 ; also on sheet 1
C2_ANGLE: U1.8(PC0)
C2_BOOST: DP5.5 DP5.6 DP5.7 DP5.8 ; also on sheet 1
C2_CLIM0: R64.2 SW2.2 ; also on sheet 1
C2_CLIM1: DP4.5 DP4.6 DP4.7 DP4.8 ; also on sheet 1
C2_CLK: U1.61(PB8) ; also on sheet 1
C2_DIR: U1.54(PD2) ; also on sheet 1
C2_DMODE0: U10.26(GPA5) ; also on sheet 1
C2_DMODE1: U10.27(GPA6) ; also on sheet 1
C2_DMODE2: U10.28(GPA7) ; also on sheet 1
C2_EN: U1.55(PB3) ; also on sheet 1
C2_FLIM: DP6.5 DP6.6 DP6.7 DP6.8 ; also on sheet 1
C2_LO1: U10.1(GPB0) ; also on sheet 1
C2_LO2: U10.2(GPB1) ; also on sheet 1
C2_VCC: DP4.1 DP5.1 DP6.1 R64.1 R65.1 R67.1 R69.1 R108.1 ; also on sheet 1
C3_AGC: R109.2 SW10.2 ; also on sheet 1
C3_ANGLE: U1.9(PC1)
C3_BOOST: DP8.5 DP8.6 DP8.7 DP8.8 ; also on sheet 1
C3_CLIM0: R71.2 SW3.2 ; also on sheet 1
C3_CLIM1: DP7.5 DP7.6 DP7.7 DP7.8 ; also on sheet 1
C3_CLK: U1.62(PB9) ; also on sheet 1
C3_DIR: U1.52(PC11) ; also on sheet 1
C3_DMODE0: U10.5(GPB4) ; also on sheet 1
C3_DMODE1: U10.4(GPB3) ; also on sheet 1
C3_DMODE2: U10.3(GPB2) ; also on sheet 1
C3_EN: U1.53(PC12) ; also on sheet 1
C3_FLIM: DP9.5 DP9.6 DP9.7 DP9.8 ; also on sheet 1
C3_LO1: U10.7(GPB6) ; also on sheet 1
C3_LO2: U10.6(GPB5) ; also on sheet 1
C3_VCC: DP7.1 DP8.1 DP9.1 R71.1 R72.1 R74.1 R76.1 R109.1 ; also on sheet 1
C4_AGC: R110.2 SW11.2 ; also on sheet 1
C4_ANGLE: U1.11(PC3)
C4_BOOST: DP11.5 DP11.6 DP11.7 DP11.8 ; also on sheet 1
C4_CLIM0: R78.2 SW4.2 ; also on sheet 1
C4_CLIM1: DP10.5 DP10.6 DP10.7 DP10.8 ; also on sheet 1
C4_CLK: U1.14(PA0) ; also on sheet 1
C4_DIR: U1.50(PA15) ; also on sheet 1
C4_DMODE0: U10.8(GPB7) ; also on sheet 1
C4_DMODE1: U11.22(GPA1) ; also on sheet 1
C4_DMODE2: U11.21(GPA0) ; also on sheet 1
C4_EN: U1.51(PC10) ; also on sheet 1
C4_FLIM: DP12.5 DP12.6 DP12.7 DP12.8 ; also on sheet 1
C4_LO1: U11.24(GPA3) ; also on sheet 1
C4_LO2: U11.23(GPA2) ; also on sheet 1
C4_VCC: DP10.1 DP11.1 DP12.1 R78.1 R79.1 R81.1 R83.1 R110.1 ; also on sheet 1
C5_AGC: R111.2 SW12.2 ; also on sheet 1
C5_ANGLE: U1.24(PC4)
C5_BOOST: DP14.5 DP14.6 DP14.7 DP14.8 ; also on sheet 1
C5_CLIM0: R85.2 SW5.2 ; also on sheet 1
C5_CLIM1: DP13.5 DP13.6 DP13.7 DP13.8 ; also on sheet 1
C5_CLK: U1.22(PA6) ; also on sheet 1
C5_DIR: U1.39(PC8) ; also on sheet 1
C5_DMODE0: U11.27(GPA6) ; also on sheet 1
C5_DMODE1: U11.26(GPA5) ; also on sheet 1
C5_DMODE2: U11.25(GPA4) ; also on sheet 1
C5_EN: U1.38(PC7) ; also on sheet 1
C5_FLIM: DP15.5 DP15.6 DP15.7 DP15.8 ; also on sheet 1
C5_LO1: U11.1(GPB0) ; also on sheet 1
C5_LO2: U11.2(GPB1) ; also on sheet 1
C5_VCC: DP13.1 DP14.1 DP15.1 R85.1 R86.1 R88.1 R90.1 R111.1 ; also on sheet 1
C6_AGC: R112.2 SW13.2 ; also on sheet 1
C6_ANGLE: U1.25(PC5)
C6_BOOST: DP17.5 DP17.6 DP17.7 DP17.8 ; also on sheet 1
C6_CLIM0: R92.2 SW6.2 ; also on sheet 1
C6_CLIM1: DP16.5 DP16.6 DP16.7 DP16.8 ; also on sheet 1
C6_CLK: U1.23(PA7) ; also on sheet 1
C6_DIR: U1.45(PA12) ; also on sheet 1
C6_DMODE0: U11.5(GPB4) ; also on sheet 1
C6_DMODE1: U11.4(GPB3) ; also on sheet 1
C6_DMODE2: U11.3(GPB2) ; also on sheet 1
C6_EN: U1.44(PA11) ; also on sheet 1
C6_FLIM: DP18.5 DP18.6 DP18.7 DP18.8 ; also on sheet 1
C6_LO1: U11.7(GPB6) ; also on sheet 1
C6_LO2: U11.6(GPB5) ; also on sheet 1
C6_VCC: DP16.1 DP17.1 DP18.1 R92.1 R93.1 R95.1 R97.1 R112.1 ; also on sheet 1
C7_AGC: R113.2 SW14.2 ; also on sheet 1
C7_BOOST: DP20.5 DP20.6 DP20.7 DP20.8 ; also on sheet 1
C7_CLIM0: R99.2 SW7.2 ; also on sheet 1
C7_CLIM1: DP19.5 DP19.6 DP19.7 DP19.8 ; also on sheet 1
C7_CLK: U1.35(PB14) ; also on sheet 1
C7_DIR: U1.43(PA10) ; also on sheet 1
C7_DMODE0: U12.25(GPA4) ; also on sheet 1
C7_DMODE1: U12.24(GPA3) ; also on sheet 1
C7_DMODE2: U12.23(GPA2) ; also on sheet 1
C7_EN: U1.42(PA9) ; also on sheet 1
C7_FLIM: DP21.5 DP21.6 DP21.7 DP21.8 ; also on sheet 1
C7_LO1: U12.22(GPA1) ; also on sheet 1
C7_LO2: U12.21(GPA0) ; also on sheet 1
C7_VCC: DP19.1 DP20.1 DP21.1 R99.1 R100.1 R102.1 R104.1 R113.1 ; also on sheet 1
DTR: Q2.2(E) R131.2 U13.28(DTR)
ESP32_D+: R163.1 U9.14(IO20)
ESP32_D-: R164.1 U9.13(IO19)
ESP32_EXTR_5V: D2.5(VBUS) U26.6(VIN2) USB2.A4B9(VBUS) USB2.B4A9(VBUS)
ESP32_EXTR_D+: D2.4(I/O2) USB2.A6(Dp1) USB2.B6(Dp2)
ESP32_EXTR_D-: D2.6(I/O1) USB2.A7(Dn1) USB2.B7(Dn2)
ESP_BOOT: Q2.3(C) R180.2 SW17.1 U9.27(IO0)
ESP_NRESET: Q1.3(C) R181.2 SW18.1 U9.3(EN)
ESP_RX2TX: U9.36(RXD0) U13.26(TXD)
ESP_TX2RX: U9.37(TXD0) U13.25(RXD)
EXT_SCK: H1.2 H2.2 H3.2 R175.2 U1.41(PA8) U10.12(SCK) U11.12(SCK) U12.12(SCK) U20.22(SCL) U21.22(SCL) U24.1(SCL) U25.1(SCL) ; also on sheet 1
EXT_SDA: H1.1 H2.1 H3.1 R174.2 U1.40(PC9) U10.13(SDA) U11.13(SDA) U12.13(SDA) U20.23(SDA) U21.23(SDA) U24.6(SDA) U25.6(SDA) ; also on sheet 1
FAN_PWM_0: R144.2 R153.1 U9.4(IO4)
FAN_PWM_1: R149.2 R152.1 U9.6(IO6)
FAN_PWM_LINE_0: Q4.3(C) R148.1 U18.4
FAN_PWM_LINE_1: Q5.3(C) R151.1 U19.4
FAN_SENSE_0: R171.1 U9.5(IO5) U18.1
FAN_SENSE_1: R185.2 U9.7(IO7) U19.1
RTS: Q1.2(E) R130.2 U13.24(RTS)
SC0: H6.2 U20.5(SC0)
SC1: H6.4 U20.7(SC1)
SC2: H6.6 U20.9(SC2)
SC3: H6.8 U20.11(SC3)
SC4: H6.10 U20.14(SC4)
SC5: H6.12 U20.16(SC5)
SC6: H6.14 U20.18(SC6)
SC7: H6.16 U20.20(SC7)
SC8: H6.18 U21.5(SC0)
SC9: H6.20 U21.7(SC1)
SC10: H6.22 U21.9(SC2)
SC11: H6.24 U21.11(SC3)
SC12: H6.26 U21.14(SC4)
SC13: H6.28 U21.16(SC5)
SC14: H6.30 U21.18(SC6)
SC15: H6.32 U21.20(SC7)
SD0: H6.1 U20.4(SD0)
SD1: H6.3 U20.6(SD1)
SD2: H6.5 U20.8(SD2)
SD3: H6.7 U20.10(SD3)
SD4: H6.9 U20.13(SD4)
SD5: H6.11 U20.15(SD5)
SD6: H6.13 U20.17(SD6)
SD7: H6.15 U20.19(SD7)
SD8: H6.17 U21.4(SD0)
SD9: H6.19 U21.6(SD1)
SD10: H6.21 U21.8(SD2)
SD11: H6.23 U21.10(SD3)
SD12: H6.25 U21.13(SD4)
SD13: H6.27 U21.15(SD5)
SD14: H6.29 U21.17(SD6)
SD15: H6.31 U21.19(SD7)
SPI_CLK: U1.29(PB10) U9.20(IO12)
SPI_MISO: U1.10(PC2) U9.21(IO13)
SPI_MOSI: U1.36(PB15) U9.19(IO11)
SPI_NSS: U1.33(PB12) U9.18(IO10)
STM_NRESET: CN8.10 Q6.3(C) R168.2 SW19.1 U1.7(NRST)
STM_NRESET_FROM_ESP: R169.2 U9.29(IO36)
SWDCLK: CN8.4 U1.49(PA14)
SWDIO: CN8.2 U1.46(PA13)
TPS563252_EN: R154.2 R155.1 U22.5(EN)
UART_D+: D1.3(I/O2) U13.4(D+)
UART_D-: D1.1(I/O1) U13.5(D-)
UART_EXTR_5V: D1.5(VBUS) R117.2 R165.1 U26.3(VIN1) U26.5(MODE) USB1.A4B9(VBUS) USB1.B4A9(VBUS)
UART_EXTR_D+: D1.4(I/O2) USB1.A6(Dp1) USB1.B6(Dp2)
UART_EXTR_D-: D1.6(I/O1) USB1.A7(Dn1) USB1.B7(Dn2)
UART_STM32_RX2TX: H7.1 U1.17(PA3)
UART_STM32_TX2RX: H7.2 U1.16(PA2)
VCAP: C1.2 U1.30(VCAP_1)
VM: C26.2 C27.2 C28.2 C29.2 C30.2 C31.2 C32.2 C33.2 SW15.2 SW16.2 U15.3(VIN) U16.3(VIN) ; also on sheet 1
VMTO3V3: C38.2 C39.2 L1.2 R136.1 R159.1 U23.3(VIN1) U23.5(MODE)
$2N2721: R106.1 U11.15(A0)
$2N5088: R114.1 U12.16(A1)
$2N8952: R115.2 USB1.A5(CC1)
$2N8956: R116.2 USB1.B5(CC2)
$2N11165: R117.1 R118.1 U13.8(VBUS)
$2N23969: Q2.1(B) R130.1
$2N24008: Q1.1(B) R131.1
$2N25565: C34.2 U16.6(CB)
$2N25569: C34.1 L1.1 U16.5(SW)
$2N25612: C35.1 L2.1 U15.5(SW)
$2N25615: C35.2 U15.6(CB)
$2N25938: R134.2 R135.1 U15.1(FB)
$2N26132: R136.2 R137.1 U16.1(FB)
$2N29401: R141.2 USB2.B5(CC2)
$2N29403: R140.2 USB2.A5(CC1)
$2N33464: Q4.1(B) R144.1
$2N36945: Q5.1(B) R149.1
$2N41272: L3.2 U22.2(SW)
$2N41417: R156.1 U22.4(PG)
$2N42214: R159.2 R160.1 U23.4(PR1)
$2N42364: R161.1 TP29.1 U23.8(ST)
$2N50382: D2.1(I/O1) R164.2
$2N50384: D2.3(I/O2) R163.2
$2N50644: R165.2 R166.1 U26.4(PR1)
$2N50645: R167.1 TP30.1 U26.8(ST)
$2N59124: Q6.1(B) R169.1
$2N76447: LED1.2(K) R172.2
$2N76539: LED1.1(A) U1.2(PC13)
$2N76635: LED2.2(K) R173.2
$2N76637: LED2.1(A) U9.9(IO16)
$2N94633: R176.1 U12.18(RESET#)
$2N94697: R177.1 U11.18(RESET#)
$2N99390: R178.1 U10.18(RESET#)
$2N99396: R157.1 R158.2 U22.6(FB)
$3N696: DP1.2 R10.2
$3N707: DP1.3 R11.2
$3N1152: DP2.2 R12.2
$3N1155: DP2.3 R13.2
$3N1356: DP3.2 R14.2
$3N1359: DP3.3 R15.2
$3N2412: DP6.3 R70.2
$3N2418: DP4.3 R66.2
$3N2423: DP5.2 R67.2
$3N2425: DP4.2 R65.2
$3N2428: DP5.3 R68.2
$3N2431: DP6.2 R69.2
$3N3105: DP9.3 R77.2
$3N3111: DP7.3 R73.2
$3N3116: DP8.2 R74.2
$3N3118: DP7.2 R72.2
$3N3121: DP8.3 R75.2
$3N3124: DP9.2 R76.2
$3N9881: DP13.3 R87.2
$3N9882: DP13.2 R86.2
$3N9885: DP15.2 R90.2
$3N9887: DP15.3 R91.2
$3N9891: DP14.2 R88.2
$3N9894: DP14.3 R89.2
$3N9903: DP16.3 R94.2
$3N9906: DP17.2 R95.2
$3N9907: DP17.3 R96.2
$3N9910: DP16.2 R93.2
$3N9916: DP18.2 R97.2
$3N9917: DP18.3 R98.2
$3N9925: DP12.3 R84.2
$3N9926: DP12.2 R83.2
$3N9929: DP10.2 R79.2
$3N9932: DP10.3 R80.2
$3N9940: DP11.3 R82.2
$3N9941: DP11.2 R81.2
$3N12004: DP21.3 R105.2
$3N12005: DP21.2 R104.2
$3N12008: DP19.2 R100.2
$3N12011: DP19.3 R101.2
$3N12019: DP20.3 R103.2
$3N12020: DP20.2 R102.2

Not connected (* = marked no-connect by the designer): CN8 6* 7* 8* 9*; SW15 3; SW16 3; U1 1(VBAT) 3(PC14-OSC32_IN) 4(PC15-OSC32_OUT) 5(PH0-OSC_IN) 6(PH1-OSC_OUT) 15(PA1) 20(PA4) 21(PA5) 34(PB13) 37(PC6) 59(PB7); U9 8(IO15) 10(IO17) 11(IO18) 12(IO8) 15(IO3) 16(IO46) 17(IO9) 22(IO14) 23(IO21) 24(IO47) 25(IO48) 26(IO45) 30(IO37) 31(IO38) 32(IO39) 33(IO40) 34(IO41) 35(IO42) 38(IO2) 39(IO1); U10 11(NC) 14(NC) 19(INTB) 20(INTA); U11 8(GPB7) 11(NC) 14(NC) 19(INTB) 20(INTA) 28(GPA7); U12 1(GPB0) 2(GPB1) 3(GPB2) 4(GPB3) 5(GPB4) 6(GPB5) 7(GPB6) 8(GPB7) 11(NC) 14(NC) 19(INTB) 20(INTA) 26(GPA5) 27(GPA6) 28(GPA7); U13 1(DCD) 2(RI/CLK) 9(RSTb) 10(NC) 11(SUSPENDb) 12(SUSPEND) 13(CHREN) 14(CHR1) 15(CHR0) 16(GPIO.3/WAKEUP) 17(GPIO.2/RS485) 18(GPIO.1/RXT) 19(GPIO.0/TXT) 20(GPIO.6) 21(GPIO.5) 22(GPIO.4) 23(CTS) 27(DSR); U24 3(ALERT); U25 3(ALERT); USB1 A8(SBU1)* B8(SBU2)*; USB2 A8(SBU1)* B8(SBU2)*

## Notes on the sheets
sheet 2
- I2C Max Clock
- I2C Address
- 1.7 MHz    MCP23017
- 0x20 GPIO EXTENDER 0 MCP23017-E/SS
- 2.85 MHz  TMP112
- 0x21 GPIO EXTENDER 1 MCP23017-E/SS
- 0x22 GPIO EXTENDER 2 MCP23017-E/SS
- 0x48 Temperature sensor 0 TMP112DQDRLRQ1 (STEP DRIVER)
- 0x49 Temperature sensor 1 TMP112DQDRLRQ1 (POWER)
- 0x4A I_LIMIT DAC53608
- 0x70 I2C MUX TCA9548APWR 0
- 0x71 TCA9548APWR 1
- TEMPERATURE
- USB_UART
- Power Consumption (max)
- Power Supply
- 13.7 mA. cp2102        3V3
- 2.5A. LMR51625                     3V3  FROM VM
- 0.04 mA. tmp112        3V3
- 3A.    TPS563252DRLR          3V3. FROM VBUS
- 340 mA.  esp32-s3     3V3
- FAN
- 240 mA.  stm32f446   3V3
- 2.5A. LMR51625                     12V  FROM VM
- USB_ESP32
- I2C Expose
- 100 mA.  tca9548a     3V3
- 100 mA.  tca9548a     3V3
- 125 mA.  mcp23017   3V3
- 125 mA.  mcp23017   3V3
- 125 mA.  mcp23017   3V3
- => 1,168.74mA
- 2A.  PFR0612DHE     12V
- ESP32 BOOT,RESET STM32 RESET
- GPIO EXTENDER
- FROM VM
- FROM VBUS
- POWER SELECT
- MCU
- ESP32
- VCAP
- VDD
- Each VDD
- CP2102 VDD
- DCOUPLING
